# EAGLE schematic thermoregulation_driver (EAGLE 9.7.0)
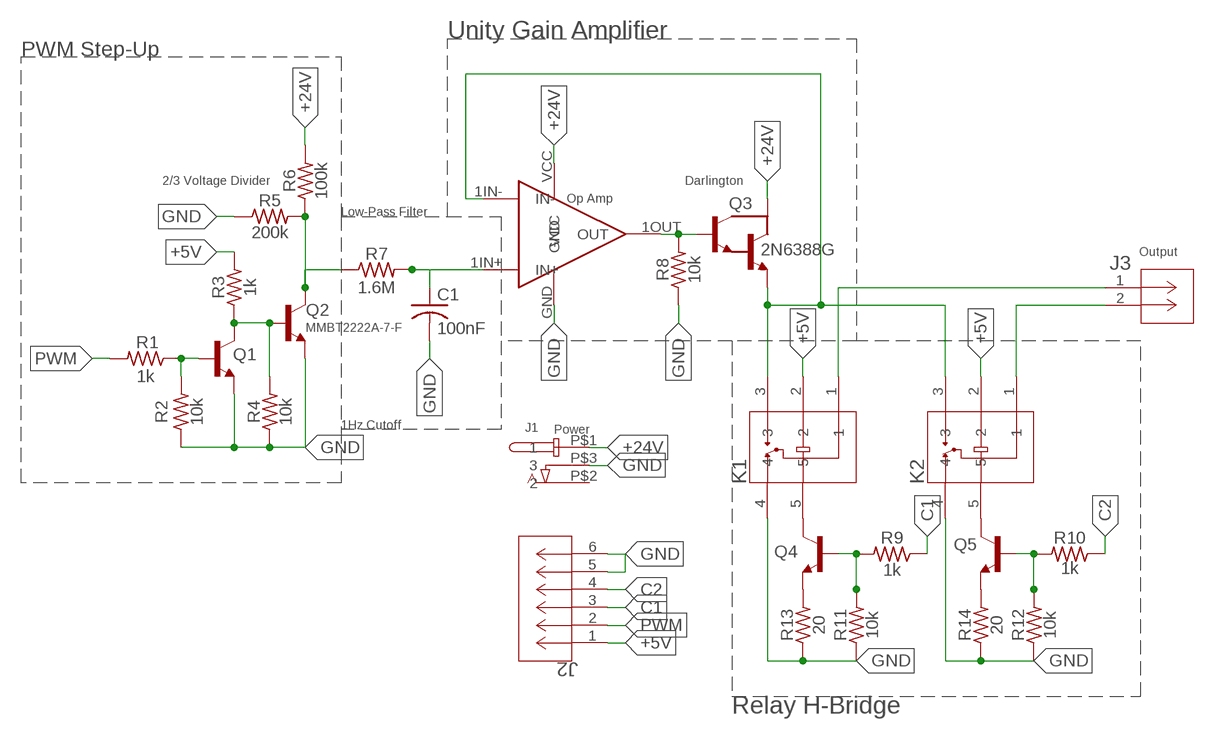
[diagram p0: schematic, sheet 1]

## Parts
C1  100nF  C-US_CHIP-0402(1005-METRIC)  [CAPC1005X60]
J1  DCBARRELJACK  [DCBARRELJACK]
J2  MOLEX-MICROLOCK-6PIN  [CON_5055670671]
J3  436500201CON_436500201_MOL  [CON_436500201_MOL]
K1  G5LE-14_DC12RELAY_G5LE-1_DC5_OMR  [RELAY_G5LE-1_DC5_OMR]
K2  G5LE-14_DC12RELAY_G5LE-1_DC5_OMR  [RELAY_G5LE-1_DC5_OMR]
OPAMP1  LM324N  LM324N-SINGLE  [LM324N]
Q1  NPN  NPN_SOT23-BEC  [SOT95P237X112-3N]
Q2  MMBT2222A-7-F  NPN_SOT23-BEC  [SOT95P237X112-3N]
Q3  2N6388G  [TO220]
Q4  NPN  NPN_SOT23-BEC  [SOT95P237X112-3N]
Q5  NPN  NPN_SOT23-BEC  [SOT95P237X112-3N]
R1  1k  R-US_CHIP-0402(1005-METRIC)  [RESC1005X40]
R2  10k  R-US_CHIP-0402(1005-METRIC)  [RESC1005X40]
R3  1k  R-US_CHIP-0402(1005-METRIC)  [RESC1005X40]
R4  10k  R-US_CHIP-0402(1005-METRIC)  [RESC1005X40]
R5  200k  R-US_CHIP-0402(1005-METRIC)  [RESC1005X40]
R6  100k  R-US_CHIP-0402(1005-METRIC)  [RESC1005X40]
R7  1.6M  R-US_CHIP-0402(1005-METRIC)  [RESC1005X40]
R8  10k  R-US_CHIP-0402(1005-METRIC)  [RESC1005X40]
R9  1k  R-US_CHIP-0402(1005-METRIC)  [RESC1005X40]
R10  1k  R-US_CHIP-0402(1005-METRIC)  [RESC1005X40]
R11  10k  R-US_CHIP-0402(1005-METRIC)  [RESC1005X40]
R12  10k  R-US_CHIP-0402(1005-METRIC)  [RESC1005X40]
R13  20  R-US_CHIP-0805(2012-METRIC)  [RESC2012X65]
R14  20  R-US_CHIP-0805(2012-METRIC)  [RESC2012X65]

## Nets
+5V: J2.1 K1.2 K2.2 R3.2
+24V: J1.P$1 OPAMP1.VCC Q3.C R6.2
C1: J2.3 R9.1
C2: J2.4 R10.1
GND: C1.2 J1.P$3 J2.5 J2.6 K1.4 K2.4 OPAMP1.GND Q1.2(E) Q2.2(E) R2.1 R4.1 R5.1 R8.1 R11.1 R12.1 R13.1 R14.1
N$1: Q2.3(C) R5.2 R6.1 R7.1
N$2: Q1.3(C) Q2.1(B) R3.1 R4.2
N$3: C1.1 OPAMP1.1IN+(IN+) R7.2
N$4: OPAMP1.1OUT(OUT) Q3.B R8.2
N$5: Q1.1(B) R1.1 R2.2
N$6: K1.3 K2.3 OPAMP1.1IN-(IN-) Q3.E
N$7: J3.1 K1.1
N$8: J3.2 K2.1
N$9: K1.5 Q4.3(C)
N$10: K2.5 Q5.3(C)
N$11: Q4.1(B) R9.2 R11.2
N$12: Q5.1(B) R10.2 R12.2
N$13: Q4.2(E) R13.2
N$14: Q5.2(E) R14.2
PWM: J2.2 R1.2
Unconnected: J1.P$2

## Notes on the sheet
- Unity Gain Amplifier
- PWM Step-Up
- 2/3 Voltage Divider | Darlington
- Op Amp
- Low-Pass Filter
- Output
- 1Hz Cutoff | Power
- Relay H-Bridge

## Library data of the parts
C1 = Capacitor:C-US: Capacitor - ANSI; CATEGORY: Capacitor
J1 = DC Barrel Jack (Locking):DCBARRELJACK
J2 = Molex Micro-Lock PLUS 6-Pin 90deg:MOLEX-MICROLOCK-6PIN
J3 = Molex Micro-Fit 2-Pin 90deg:436500201; COPYRIGHT: Copyright (C) 2022 Ultra Librarian. All rights reserved.; MANUFACTURER_PART_NUMBER: 436500201; MFR_NAME: Molex Connector Corporation
K1 K2 = G5LE-14 DC3:G5LE-14_DC12; COPYRIGHT: Copyright (C) 2022 Ultra Librarian. All rights reserved.; MANUFACTURER_PART_NUMBER: G5LE-14 DC12; MFR_NAME: Omron
OPAMP1 = LM324N:LM324N-SINGLE
Q1 Q4 Q5 = Transistor:NPN: NPN - Generic; CATEGORY: Transistor; SUB-CATEGORY: BJT; TYPE: NPN
Q2 = Transistor:NPN: NPN - Generic; CATEGORY: Transistor; SUB-CATEGORY: BJT; TYPE: NPN; VALUE: NPN
Q3 = 2N6388G:2N6388G
R1-R14 = Resistor:R-US: Resistor Fixed - ANSI; CATEGORY: Resistor; SUB-CATEGORY: Fixed